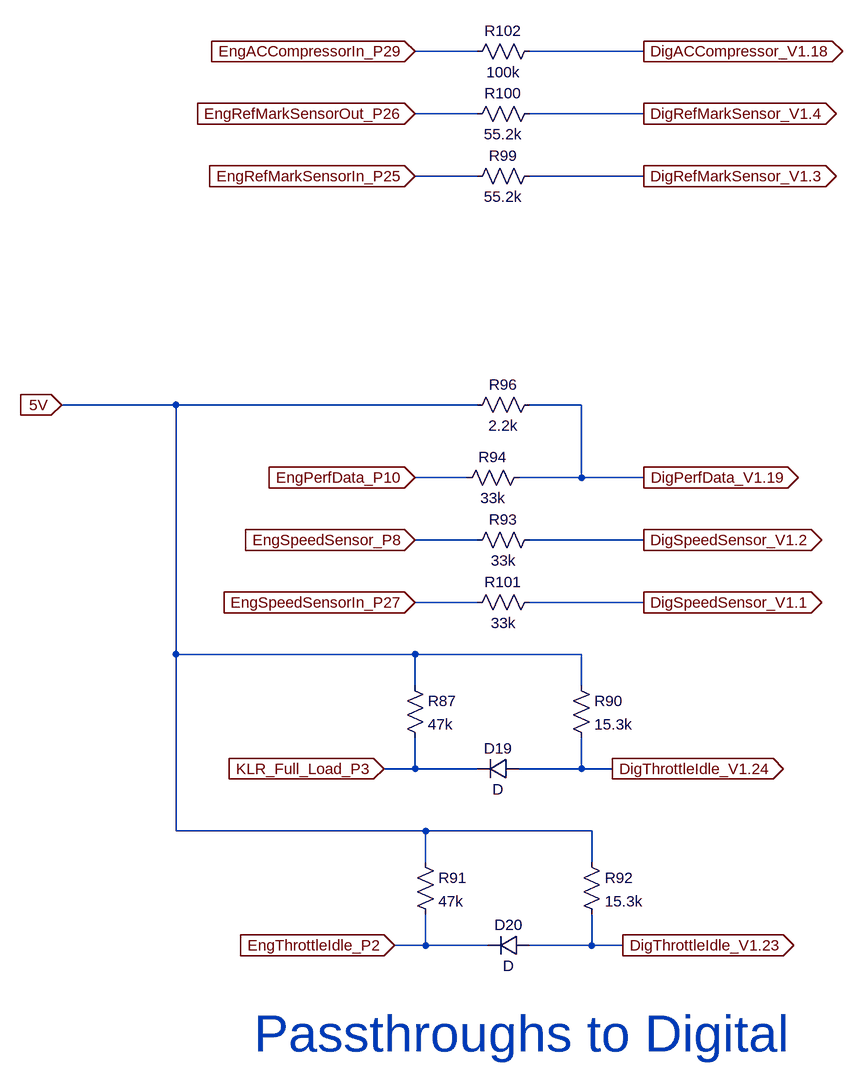
[diagram p0: schematic dme_analog_passthrough.asc]
dme_analog_passthrough.asc, the LTspice schematic file:
Version 4
SHEET 1 4356 3824
WIRE -4064 -2080 -4160 -2080
WIRE -3808 -2080 -3984 -2080
WIRE -4064 -1984 -4160 -1984
WIRE -3808 -1984 -3984 -1984
WIRE -4064 -1888 -4160 -1888
WIRE -3808 -1888 -3984 -1888
WIRE -4528 -1536 -4704 -1536
WIRE -4064 -1536 -4528 -1536
WIRE -3904 -1536 -3984 -1536
WIRE -4080 -1424 -4160 -1424
WIRE -3904 -1424 -3904 -1536
WIRE -3904 -1424 -4000 -1424
WIRE -3808 -1424 -3904 -1424
WIRE -4064 -1328 -4160 -1328
WIRE -3808 -1328 -3984 -1328
WIRE -4064 -1232 -4160 -1232
WIRE -3808 -1232 -3984 -1232
WIRE -4528 -1152 -4528 -1536
WIRE -4160 -1152 -4528 -1152
WIRE -3904 -1152 -4160 -1152
WIRE -4160 -1104 -4160 -1152
WIRE -3904 -1104 -3904 -1152
WIRE -4160 -976 -4160 -1024
WIRE -4160 -976 -4208 -976
WIRE -4064 -976 -4160 -976
WIRE -3904 -976 -3904 -1024
WIRE -3904 -976 -4000 -976
WIRE -3856 -976 -3904 -976
WIRE -4528 -880 -4528 -1152
WIRE -4144 -880 -4528 -880
WIRE -3888 -880 -4144 -880
WIRE -4144 -832 -4144 -880
WIRE -3888 -832 -3888 -880
WIRE -4144 -704 -4144 -752
WIRE -4144 -704 -4192 -704
WIRE -4048 -704 -4144 -704
WIRE -3888 -704 -3888 -752
WIRE -3888 -704 -3984 -704
WIRE -3840 -704 -3888 -704
FLAG -4208 -976 KLR_Full_Load_P3
IOPIN -4208 -976 In
FLAG -3856 -976 DigThrottleIdle_V1.24
IOPIN -3856 -976 Out
FLAG -4192 -704 EngThrottleIdle_P2
IOPIN -4192 -704 In
FLAG -3840 -704 DigThrottleIdle_V1.23
IOPIN -3840 -704 Out
FLAG -4160 -1328 EngSpeedSensor_P8
IOPIN -4160 -1328 In
FLAG -3808 -1328 DigSpeedSensor_V1.2
IOPIN -3808 -1328 Out
FLAG -4160 -1424 EngPerfData_P10
IOPIN -4160 -1424 In
FLAG -3808 -1424 DigPerfData_V1.19
IOPIN -3808 -1424 Out
FLAG -4160 -1888 EngRefMarkSensorIn_P25
IOPIN -4160 -1888 In
FLAG -3808 -1888 DigRefMarkSensor_V1.3
IOPIN -3808 -1888 Out
FLAG -4160 -1984 EngRefMarkSensorOut_P26
IOPIN -4160 -1984 In
FLAG -3808 -1984 DigRefMarkSensor_V1.4
IOPIN -3808 -1984 Out
FLAG -4160 -1232 EngSpeedSensorIn_P27
IOPIN -4160 -1232 In
FLAG -3808 -1232 DigSpeedSensor_V1.1
IOPIN -3808 -1232 Out
FLAG -4160 -2080 EngACCompressorIn_P29
IOPIN -4160 -2080 In
FLAG -3808 -2080 DigACCompressor_V1.18
IOPIN -3808 -2080 Out
FLAG -4704 -1536 5V
IOPIN -4704 -1536 In
SYMBOL Res -4176 -1120 R0
SYMATTR InstName R87
SYMATTR Value 47k
SYMBOL Res -3920 -1120 R0
SYMATTR InstName R90
SYMATTR Value 15.3k
SYMBOL Diode -4000 -992 R90
WINDOW 0 0 32 VBottom 2
WINDOW 3 32 32 VTop 2
SYMATTR InstName D19
SYMBOL Res -4160 -848 R0
SYMATTR InstName R91
SYMATTR Value 47k
SYMBOL Res -3904 -848 R0
SYMATTR InstName R92
SYMATTR Value 15.3k
SYMBOL Diode -3984 -720 R90
WINDOW 0 0 32 VBottom 2
WINDOW 3 32 32 VTop 2
SYMATTR InstName D20
SYMBOL Res -3968 -1344 R90
WINDOW 0 0 56 VBottom 2
WINDOW 3 32 56 VTop 2
SYMATTR InstName R93
SYMATTR Value 33k
SYMBOL Res -3984 -1440 R90
WINDOW 0 0 56 VBottom 2
WINDOW 3 32 56 VTop 2
SYMATTR InstName R94
SYMATTR Value 33k
SYMBOL Res -3968 -1552 R90
WINDOW 0 0 56 VBottom 2
WINDOW 3 32 56 VTop 2
SYMATTR InstName R96
SYMATTR Value 2.2k
SYMBOL Res -3968 -1904 R90
WINDOW 0 0 56 VBottom 2
WINDOW 3 32 56 VTop 2
SYMATTR InstName R99
SYMATTR Value 55.2k
SYMBOL Res -3968 -2000 R90
WINDOW 0 0 56 VBottom 2
WINDOW 3 32 56 VTop 2
SYMATTR InstName R100
SYMATTR Value 55.2k
SYMBOL Res -3968 -1248 R90
WINDOW 0 0 56 VBottom 2
WINDOW 3 32 56 VTop 2
SYMATTR InstName R101
SYMATTR Value 33k
SYMBOL Res -3968 -2096 R90
WINDOW 0 0 56 VBottom 2
WINDOW 3 32 56 VTop 2
SYMATTR InstName R102
SYMATTR Value 100k
TEXT -4408 -568 Left 6 ;Passthroughs to Digital

The netlist it stands for:
* dme_analog_passthrough.asc
R87 5V KLR_Full_Load_P3 47k
R90 5V DigThrottleIdle_V1.24 15.3k
D19 DigThrottleIdle_V1.24 KLR_Full_Load_P3 D
R91 5V EngThrottleIdle_P2 47k
R92 5V DigThrottleIdle_V1.23 15.3k
D20 DigThrottleIdle_V1.23 EngThrottleIdle_P2 D
R93 DigSpeedSensor_V1.2 EngSpeedSensor_P8 33k
R94 DigPerfData_V1.19 EngPerfData_P10 33k
R96 DigPerfData_V1.19 5V 2.2k
R99 DigRefMarkSensor_V1.3 EngRefMarkSensorIn_P25 55.2k
R100 DigRefMarkSensor_V1.4 EngRefMarkSensorOut_P26 55.2k
R101 DigSpeedSensor_V1.1 EngSpeedSensorIn_P27 33k
R102 DigACCompressor_V1.18 EngACCompressorIn_P29 100k
.model D D
.lib standard.dio
* Passthroughs to Digital
.backanno
.end